# Altium schematic sheet 04b3_BATT_CHARGER.SchDoc
size 386 x 246 mm; SheetNumber: 5
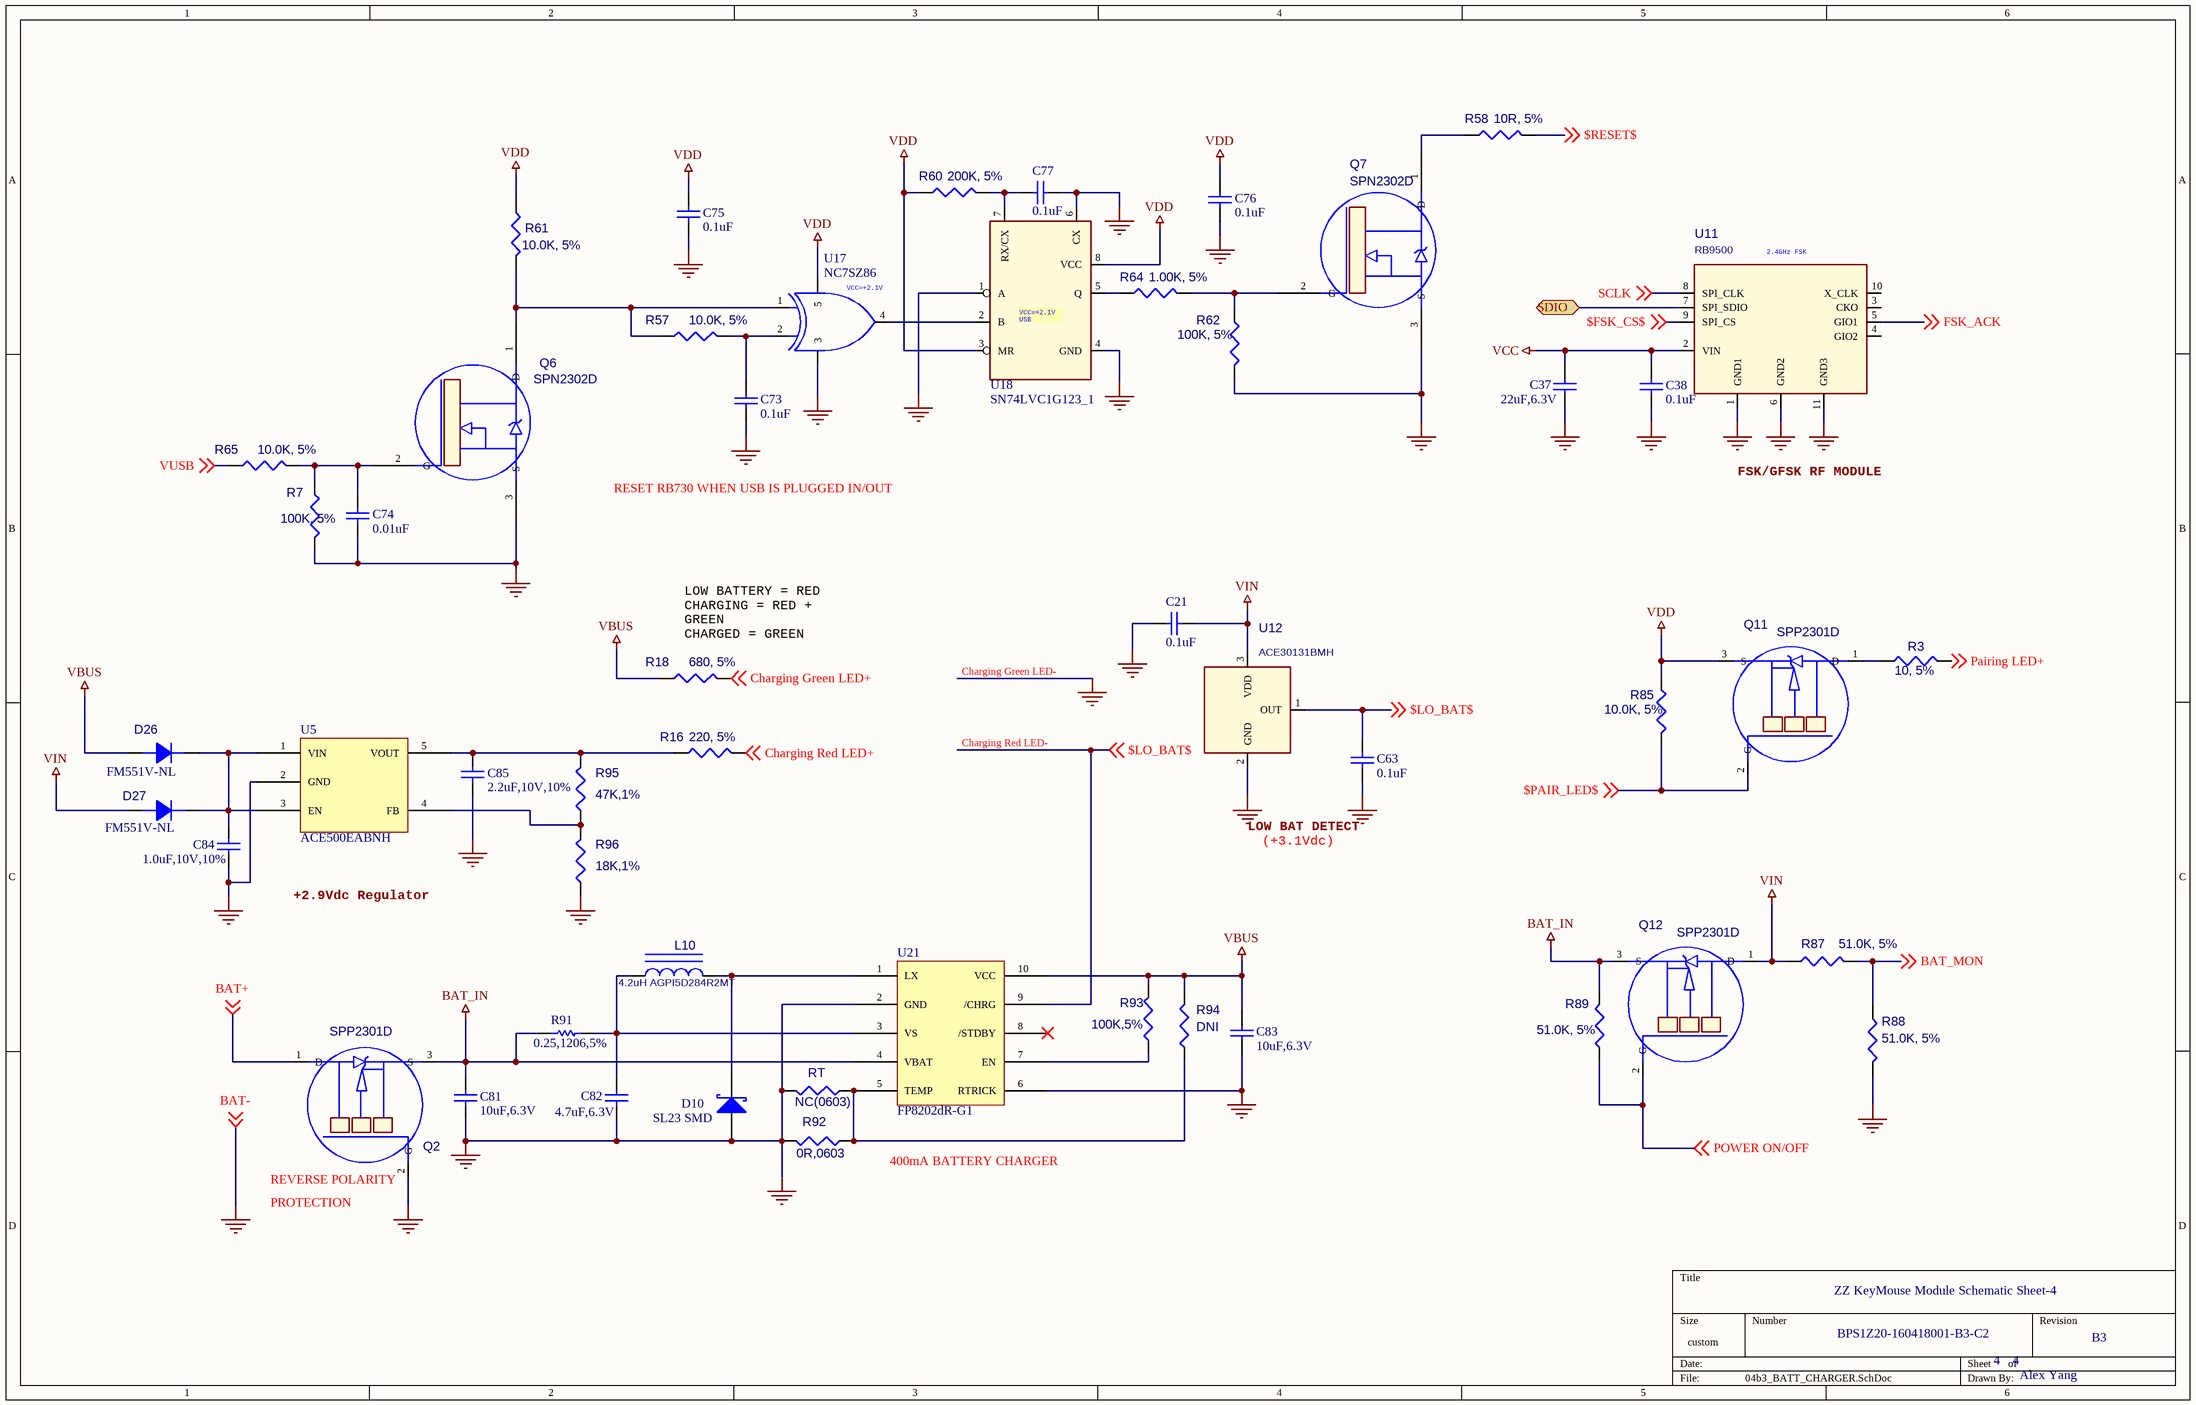
[diagram p0: 04b3_BATT_CHARGER.SchDoc]

## Parts
C21  0.1uF  [0603]
C37  22uF,6.3V  [MIN0805]
C38  0.1uF  [0603]
C63  0.1uF  [0603]
C73  0.1uF  [0603]
C74  0.01uF  [0603]
C75  0.1uF  [0603]
C76  0.1uF  [0603]
C77  0.1uF  [0603]
C81  10uF,6.3V  [0603]
C82  4.7uF,6.3V  [0603]
C83  10uF,6.3V  [0603]
C84  1.0uF,10V,10%  [0603]
C85  2.2uF,10V,10%  [0603]
D10  SL23 SMD  [Sl23]
D26  DIODE  [FM551-NL-2]  (value not drawn)
D27  DIODE  [FM551-NL-2]  (value not drawn)
L10  4.2uH AGPI5D284R2MT  [AGPI15D284R2MT]
Q2  SPP2301D  [SOT23]
Q6  SPN2302D  [SOT23]
Q7  SPN2302D  [SOT23]
Q11  SPP2301D  [SOT23]
Q12  SPP2301D  [SOT23]
R3  10, 5%  [0402]
R7  100K, 5%  [0402]
R16  220, 5%  [0402]
R18  680, 5%  [0402]
R57  10.0K, 5%  [0402]
R58  10R, 5%  [0402]
R60  200K, 5%  [0402]
R61  10.0K, 5%  [0402]
R62  100K, 5%  [0402]
R64  1.00K, 5%  [0402]
R65  10.0K, 5%  [0402]
R85  10.0K, 5%  [0402]
R87  51.0K, 5%  [0402]
R88  51.0K, 5%  [0402]
R89  51.0K, 5%  [0402]
R91  0.25,1206,5%  [1206]
R92  0R,0603  [0603]
R93  100K,5%  [0402]
R94  DNI  [0402]
R95  47K,1%  [0402]
R96  18K,1%  [0402]
RT  NC(0603)  [0603]
U5  ACE500EABNH  [SOT23-5]
U11  RB9500  [RB9500_MODULE_SMT]
U12  ACE30131BMH  [SOT23]
U17  NC7SZ86  [SC70-5]
U18  SN74LVC1G123_1  [US8_ON_SEMI_2MMX2.3MM]
U21  FP8202dR-G1  [DFN10]

## Ports
SDIO (bidir)

## Nets
BAT_IN: C81.2 Q2.3(S) Q12.3(S) R89.1 R91.1 U21.4(VBAT)
Charging Green LED-: C21.2 C37.1 C38.1 C63.1 C73.1 C74.1 C75.1 C76.1 C77.1 C81.1 C82.1 C83.1 C84.1 C85.1 D10.1(A) Q2.2(G) Q6.3(S) Q7.3(S) R7.1 R62.1 R88.2 R92.1 R96.2 RT.1 U5.2(GND) U11.1(GND1) U11.6(GND2) U11.11(GND3) U12.2(GND) U17.3 U18.1(A) U18.4(GND) U18.6(CX) U21.2(GND) U21.6(RTRICK) ; off-sheet BAT-  [also labelled BAT-, GND]
VBUS: C83.2 D26.A R18.1 R93.1 R94.1 U21.10(VCC)
VCC: C37.2 C38.2 U11.2(VIN)
VDD: C75.2 C76.2 Q11.3(S) R60.1 R61.1 R85.1 U17.5 U18.3(MR) U18.8(VCC)
VIN: C21.1 D27.A Q12.1(D) R87.1 U12.3(VDD)
$FSK_CS$: U11.9(SPI_CS) ; off-sheet $FSK_CS$
$PAIR_LED$: Q11.2(G) R85.2 ; off-sheet $PAIR_LED$
$RESET$: R58.2 ; off-sheet $RESET$
BAT+: Q2.1(D) ; off-sheet BAT+
BAT_MON: R87.2 R88.1 ; off-sheet BAT_MON
Charging Green LED+: R18.2 ; off-sheet Charging Green LED+
Charging Red LED+: R16.2 ; off-sheet Charging Red LED+
Charging Red LED-: C63.2 U12.1(OUT) U21.9(/CHRG) ; off-sheet $LO_BAT$  [also labelled $LO_BAT$]
FSK_ACK: U11.5(GIO1) ; off-sheet FSK_ACK
Pairing LED+: R3.2 ; off-sheet Pairing LED+
POWER ON/OFF: Q12.2(G) R89.2 ; off-sheet POWER ON/OFF
SCLK: U11.8(SPI_CLK) ; off-sheet SCLK
SDIO: U11.7(SPI_SDIO) ; port SDIO
VUSB: R65.1 ; off-sheet VUSB
NetC73_2: C73.2 R57.2 U17.2
NetC74_2: C74.2 Q6.2(G) R7.2 R65.2
NetC77_2: C77.2 R60.2 U18.7(RX/CX)
NetC82_2: C82.2 L10.1 R91.2 U21.3(VS)
NetC84_2: C84.2 D26.K D27.K U5.1(VIN) U5.3(EN)
NetC85_2: C85.2 R16.1 R95.1 U5.5(VOUT)
NetD10_2: D10.2(K) L10.2 U21.1(LX)
NetQ6_1: Q6.1(D) R57.1 R61.2 U17.1
NetQ7_1: Q7.1(D) R58.1
NetQ7_2: Q7.2(G) R62.2 R64.2
NetQ11_1: Q11.1(D) R3.1
NetR64_1: R64.1 U18.5(Q)
NetR92_2: R92.2 R94.2 RT.2 U21.5(TEMP)
NetR93_2: R93.2 U21.7(EN)
NetR95_2: R95.2 R96.1 U5.4(FB)
NetU17_4: U17.4 U18.2(B)

Not connected (* = marked no-connect by the designer): U11 3(CKO) 4(GIO2) 10(X_CLK); U21 8(/STDBY)*

## Notes on the sheet
- RESET RB730 WHEN USB IS PLUGGED IN/OUT
- FSK/GFSK RF MODULE
- (near R18) LOW BATTERY = RED
  CHARGING = RED + GREEN
  CHARGED = GREEN
- LOW BAT DETECT
- (+3.1Vdc)
- +2.9Vdc Regulator
- (near Q2) REVERSE POLARITY
- (near Q2) PROTECTION
- 400mA BATTERY CHARGER
- ZZ KeyMouse Module Schematic Sheet-4
- BPS1Z20-160418001-B3-C2
- B3
- 4
- Alex Yang
- (in symbol DIODE) FM551V-NL
- (in symbol NC7SZ86) VCC=+2.1V
- (in symbol RB9500) 2.4GHz FSK
- (in symbol SN74LVC1G123_1) VCC=+2.1V / USB

## Library data of the parts
C21 C37 C38 C63 C73-C77 C81-C85 = Cap: Capacitor
D10 = Diode BAT17: Silicon RF Schottky; Note: Pin 2 is not connected and not drawn.; Rule: PcbType=ProtelPcb; Published: 21-Mar-2003; LatestRevisionDate: 29-May-2009; LatestRevisionNote: IPC-7351 Footprint Added.; DatasheetVersion: Oct-1999; PackageVersion: Sep-2001; PackageReference: SOT-23; Publisher: Altium Limited; PackageDescription: 3-Pin SOT-23 Package 0.95 mm Pitch, 2.5 mm Lead Span; ComponentLink1Description: Manufacturer Link; ComponentLink1URL: http://www.infineon.com/; ComponentLink2Description: Datasheet; ComponentLink2URL: http://www.infineon.com/upload/Document/cmc_upload/documents/009/363/bat17series.pdf
L10 = INDUCTOR IRON
Q2 Q11 Q12 = AO3435
Q6 Q7 = AO3416
R3 R7 R16 R18 R57 R58 R60-R62 R64 R65 R85 R87-R89 R92-R96 RT = R
R91 = Res1: Resistor; Value: 1K; Published: 8-Jun-2000; LatestRevisionDate: 17-Jul-2002; LatestRevisionNote: Re-released for DXP Platform.; PackageReference: AXIAL-0.3; Publisher: Altium Limited; PackageDescription: Axial Device, Thru-Hole; 2 Leads; 0.3 in Pin Spacing
U5 = ACE500EABNH: Value: 100pF; Published: 8-Jun-2000; LatestRevisionDate: 17-Jul-2002; LatestRevisionNote: Re-released for DXP Platform.; PackageReference: RAD-0.3; Publisher: Altium Limited
U12 = STM1061N31WX6F: pin to pad: 1>2 2>3 3>1
U21 = FP8202dR-G1: Value: 100pF; Published: 8-Jun-2000; LatestRevisionDate: 17-Jul-2002; LatestRevisionNote: Re-released for DXP Platform.; PackageReference: RAD-0.3; Publisher: Altium Limited